# EAGLE design SmartVision (EAGLE 7.3.0)

## Sheet 1 of 4
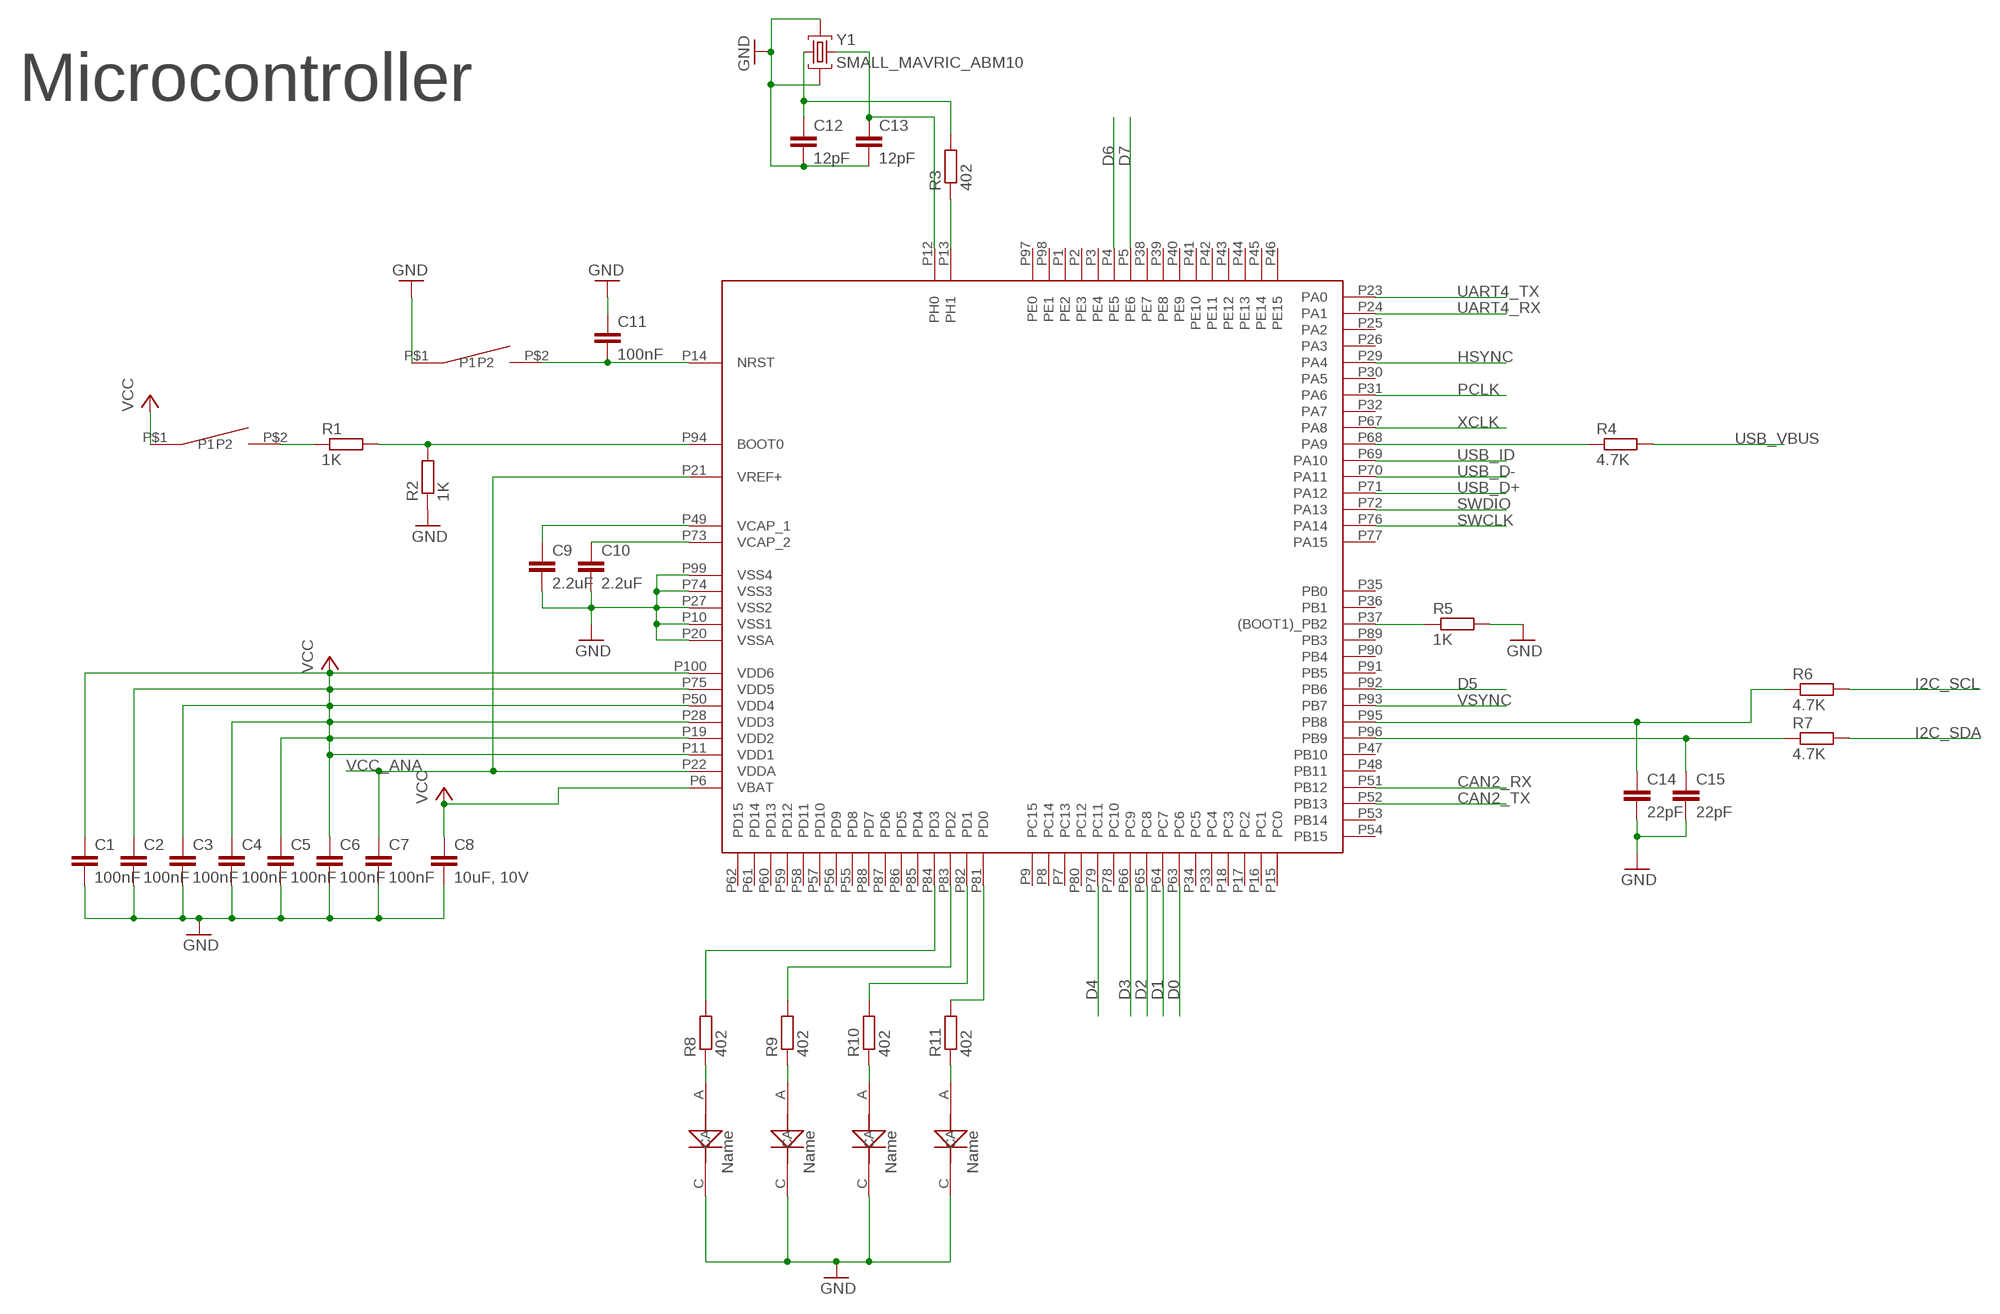
[diagram p0: schematic, sheet 1]

### Parts
C1  100nF  SMALL_MAVRIC_CAPACITOR_C0402  [SMALL_MAVRIC_SMALL_MAVRIC_CAPACITOR_C0402]
C2  100nF  SMALL_MAVRIC_CAPACITOR_C0402  [SMALL_MAVRIC_SMALL_MAVRIC_CAPACITOR_C0402]
C3  100nF  SMALL_MAVRIC_CAPACITOR_C0402  [SMALL_MAVRIC_SMALL_MAVRIC_CAPACITOR_C0402]
C4  100nF  SMALL_MAVRIC_CAPACITOR_C0402  [SMALL_MAVRIC_SMALL_MAVRIC_CAPACITOR_C0402]
C5  100nF  SMALL_MAVRIC_CAPACITOR_C0402  [SMALL_MAVRIC_SMALL_MAVRIC_CAPACITOR_C0402]
C6  100nF  SMALL_MAVRIC_CAPACITOR_C0402  [SMALL_MAVRIC_SMALL_MAVRIC_CAPACITOR_C0402]
C7  100nF  SMALL_MAVRIC_CAPACITOR_C0402  [SMALL_MAVRIC_SMALL_MAVRIC_CAPACITOR_C0402]
C8  10uF, 10V  SMALL_MAVRIC_CAPACITOR_C0603  [SMALL_MAVRIC_SMALL_MAVRIC_CAPACITOR_C0603]
C9  2.2uF  SMALL_MAVRIC_CAPACITOR_C0402  [SMALL_MAVRIC_SMALL_MAVRIC_CAPACITOR_C0402]
C10  2.2uF  SMALL_MAVRIC_CAPACITOR_C0402  [SMALL_MAVRIC_SMALL_MAVRIC_CAPACITOR_C0402]
C11  100nF  SMALL_MAVRIC_CAPACITOR_C0402  [SMALL_MAVRIC_SMALL_MAVRIC_CAPACITOR_C0402]
C12  12pF  SMALL_MAVRIC_CAPACITOR_C0402  [SMALL_MAVRIC_SMALL_MAVRIC_CAPACITOR_C0402]
C13  12pF  SMALL_MAVRIC_CAPACITOR_C0402  [SMALL_MAVRIC_SMALL_MAVRIC_CAPACITOR_C0402]
C14  22pF  SMALL_MAVRIC_CAPACITOR_C0402  [SMALL_MAVRIC_SMALL_MAVRIC_CAPACITOR_C0402]
C15  22pF  SMALL_MAVRIC_CAPACITOR_C0402  [SMALL_MAVRIC_SMALL_MAVRIC_CAPACITOR_C0402]
R1  1K  SMALL_MAVRIC_RESISTOR_R0402  [SMALL_MAVRIC_SMALL_MAVRIC_RESISTOR_R0402]
R2  1K  SMALL_MAVRIC_RESISTOR_R0402  [SMALL_MAVRIC_SMALL_MAVRIC_RESISTOR_R0402]
R3  402  SMALL_MAVRIC_RESISTOR_R0402  [SMALL_MAVRIC_SMALL_MAVRIC_RESISTOR_R0402]
R4  4.7K  SMALL_MAVRIC_RESISTOR_R0402  [SMALL_MAVRIC_SMALL_MAVRIC_RESISTOR_R0402]
R5  1K  SMALL_MAVRIC_RESISTOR_R0402  [SMALL_MAVRIC_SMALL_MAVRIC_RESISTOR_R0402]
R6  4.7K  SMALL_MAVRIC_RESISTOR_R0402  [SMALL_MAVRIC_SMALL_MAVRIC_RESISTOR_R0402]
R7  4.7K  SMALL_MAVRIC_RESISTOR_R0402  [SMALL_MAVRIC_SMALL_MAVRIC_RESISTOR_R0402]
R8  402  SMALL_MAVRIC_RESISTOR_R0402  [SMALL_MAVRIC_SMALL_MAVRIC_RESISTOR_R0402]
R9  402  SMALL_MAVRIC_RESISTOR_R0402  [SMALL_MAVRIC_SMALL_MAVRIC_RESISTOR_R0402]
R10  402  SMALL_MAVRIC_RESISTOR_R0402  [SMALL_MAVRIC_SMALL_MAVRIC_RESISTOR_R0402]
R11  402  SMALL_MAVRIC_RESISTOR_R0402  [SMALL_MAVRIC_SMALL_MAVRIC_RESISTOR_R0402]
U$1  STM32F407VGT6-100  [STM32F407VGT6-100]
U$29  SWITCH_OFF_(ON)  [SWITCH_OFF_(ON)]
U$31  SWITCH_OFF_(ON)  [SWITCH_OFF_(ON)]
U$40  LED  [LED]
U$41  LED  [LED]
U$42  LED  [LED]
U$43  LED  [LED]
Y1  SMALL_MAVRIC_ABM10  [SMALL_MAVRIC_OSCILLATOR_ABM10]

### Nets
CAN2_RX: U$1.P51(PB12) ; also sheet 3
CAN2_TX: U$1.P52(PB13) ; also sheet 3
D0: U$1.P63(PC6) ; also sheet 3
D1: U$1.P64(PC7) ; also sheet 3
D2: U$1.P65(PC8) ; also sheet 3
D3: U$1.P66(PC9) ; also sheet 3
D4: U$1.P79(PC11) ; also sheet 3
D5: U$1.P92(PB6) ; also sheet 3
D6: U$1.P4(PE5) ; also sheet 3
D7: U$1.P5(PE6) ; also sheet 3
GND: C1.2 C2.2 C3.2 C4.2 C5.2 C6.2 C7.2 C8.2 C9.2 C10.2 C11.1 C12.2 C13.2 C14.2 C15.2 R2.1 R5.2 U$1.P10(VSS1) U$1.P20(VSSA) U$1.P27(VSS2) U$1.P74(VSS3) U$1.P99(VSS4) U$29.P$1(P1) U$40.C U$41.C U$42.C U$43.C Y1.2 Y1.4 ; also sheet 2,3,4
HSYNC: U$1.P29(PA4) ; also sheet 3
I2C_SCL: R6.2 ; also sheet 3,4
I2C_SDA: R7.2 ; also sheet 3,4
N$4: R11.2 U$1.P81(PD0)
N$5: R10.2 U$1.P82(PD1)
N$6: R9.2 U$1.P83(PD2)
N$7: R8.2 U$1.P84(PD3)
N$8: C13.1 U$1.P12(PH0) Y1.3
N$9: R8.1 U$40.A
N$10: C12.1 R3.2 Y1.1
N$11: R9.1 U$41.A
N$12: R10.1 U$42.A
N$13: R3.1 U$1.P13(PH1)
N$14: C15.1 R7.1 U$1.P96(PB9)
N$15: C9.1 U$1.P49(VCAP_1)
N$16: C10.1 U$1.P73(VCAP_2)
N$17: C14.1 R6.1 U$1.P95(PB8)
N$18: R4.1 U$1.P68(PA9)
N$19: C11.2 U$1.P14(NRST) U$29.P$2(P2)
N$20: R1.1 U$31.P$2(P2)
N$21: R1.2 R2.2 U$1.P94(BOOT0)
N$22: R5.1 U$1.P37((BOOT1)_PB2)
N$23: R11.1 U$43.A
PCLK: U$1.P31(PA6) ; also sheet 3
SWCLK: U$1.P76(PA14) ; also sheet 3
SWDIO: U$1.P72(PA13) ; also sheet 3
UART4_RX: U$1.P24(PA1) ; also sheet 3
UART4_TX: U$1.P23(PA0) ; also sheet 3
USB_D+: U$1.P71(PA12) ; also sheet 3
USB_D-: U$1.P70(PA11) ; also sheet 3
USB_ID: U$1.P69(PA10) ; also sheet 3
USB_VBUS: R4.2 ; also sheet 2,3
VCC: C1.1 C2.1 C3.1 C4.1 C5.1 C6.1 C8.1 U$1.P6(VBAT) U$1.P11(VDD1) U$1.P19(VDD2) U$1.P28(VDD3) U$1.P50(VDD4) U$1.P75(VDD5) U$1.P100(VDD6) U$31.P$1(P1) ; also sheet 2,3,4
VCC_ANA: C7.1 U$1.P21(VREF+) U$1.P22(VDDA) ; also sheet 2,3,4
VSYNC: U$1.P93(PB7) ; also sheet 3
XCLK: U$1.P67(PA8) ; also sheet 3
Unconnected: U$1.P1(PE2) U$1.P2(PE3) U$1.P3(PE4) U$1.P7(PC13) U$1.P8(PC14) U$1.P9(PC15) U$1.P15(PC0) U$1.P16(PC1) U$1.P17(PC2) U$1.P18(PC3) U$1.P25(PA2) U$1.P26(PA3) U$1.P30(PA5) U$1.P32(PA7) U$1.P33(PC4) U$1.P34(PC5) U$1.P35(PB0) U$1.P36(PB1) U$1.P38(PE7) U$1.P39(PE8) U$1.P40(PE9) U$1.P41(PE10) U$1.P42(PE11) U$1.P43(PE12) U$1.P44(PE13) U$1.P45(PE14) U$1.P46(PE15) U$1.P47(PB10) U$1.P48(PB11) U$1.P53(PB14) U$1.P54(PB15) U$1.P55(PD8) U$1.P56(PD9) U$1.P57(PD10) U$1.P58(PD11) U$1.P59(PD12) U$1.P60(PD13) U$1.P61(PD14) U$1.P62(PD15) U$1.P77(PA15) U$1.P78(PC10) U$1.P80(PC12) U$1.P85(PD4) U$1.P86(PD5) U$1.P87(PD6) U$1.P88(PD7) U$1.P89(PB3) U$1.P90(PB4) U$1.P91(PB5) U$1.P97(PE0) U$1.P98(PE1)

### Notes on the sheet
- Microcontroller

## Sheet 2 of 4
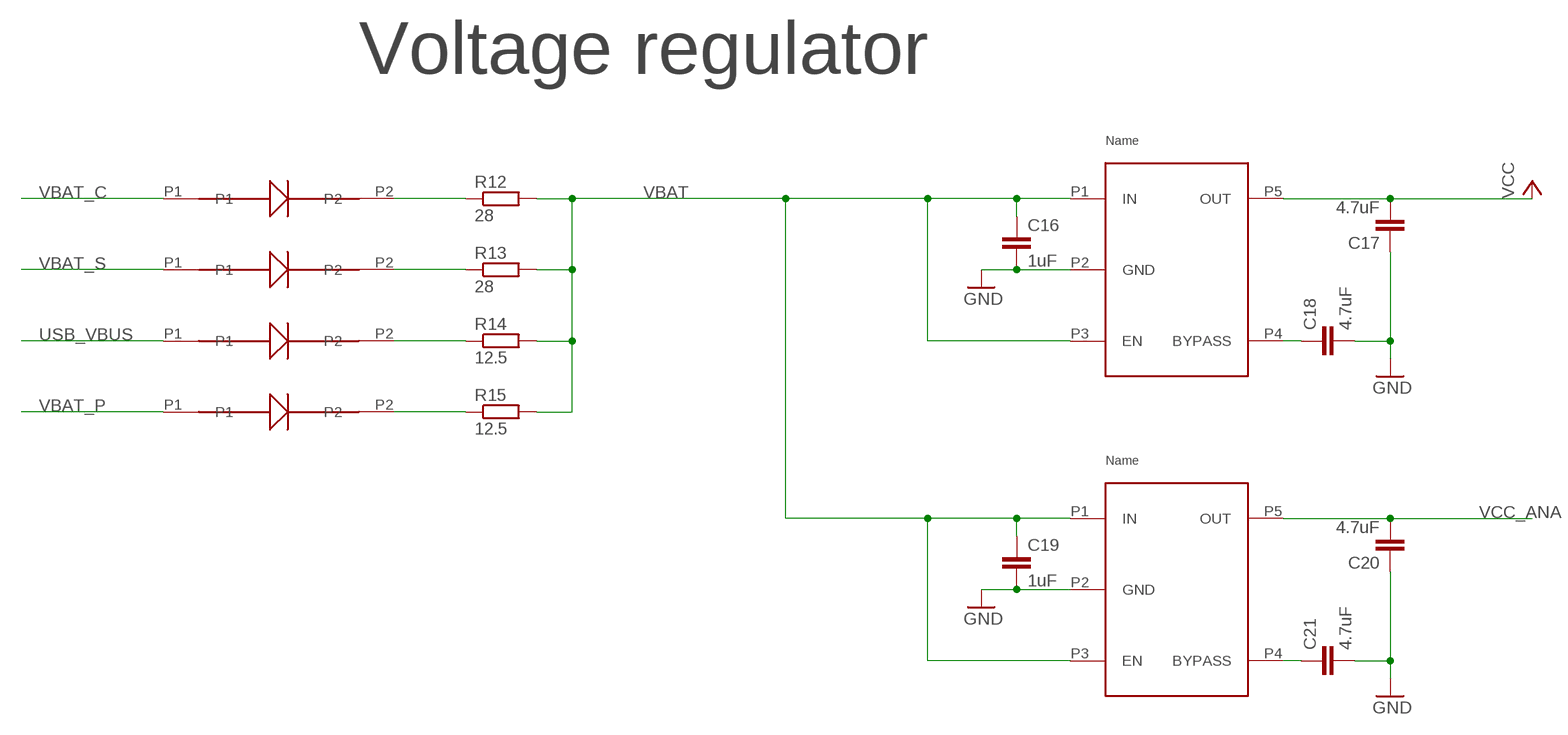
[diagram p1: schematic, sheet 2]

### Parts
C16  1uF  SMALL_MAVRIC_CAPACITOR_C0402  [SMALL_MAVRIC_SMALL_MAVRIC_CAPACITOR_C0402]
C17  4.7uF  SMALL_MAVRIC_CAPACITOR_C0603  [SMALL_MAVRIC_SMALL_MAVRIC_CAPACITOR_C0603]
C18  4.7uF  SMALL_MAVRIC_CAPACITOR_C0603  [SMALL_MAVRIC_SMALL_MAVRIC_CAPACITOR_C0603]
C19  1uF  SMALL_MAVRIC_CAPACITOR_C0402  [SMALL_MAVRIC_SMALL_MAVRIC_CAPACITOR_C0402]
C20  4.7uF  SMALL_MAVRIC_CAPACITOR_C0603  [SMALL_MAVRIC_SMALL_MAVRIC_CAPACITOR_C0603]
C21  4.7uF  SMALL_MAVRIC_CAPACITOR_C0603  [SMALL_MAVRIC_SMALL_MAVRIC_CAPACITOR_C0603]
R12  28  SMALL_MAVRIC_RESISTOR_R0402  [SMALL_MAVRIC_SMALL_MAVRIC_RESISTOR_R0402]
R13  28  SMALL_MAVRIC_RESISTOR_R0402  [SMALL_MAVRIC_SMALL_MAVRIC_RESISTOR_R0402]
R14  12.5  SMALL_MAVRIC_RESISTOR_R0402  [SMALL_MAVRIC_SMALL_MAVRIC_RESISTOR_R0402]
R15  12.5  SMALL_MAVRIC_RESISTOR_R0402  [SMALL_MAVRIC_SMALL_MAVRIC_RESISTOR_R0402]
U$2  VOLTAGE_REGULATOR_3V  [VOLTAGE_REGULATOR_3V]
U$7  VOLTAGE_REGULATOR_3V  [VOLTAGE_REGULATOR_3V]
U$54  DIODE_SCHOTTKY  [DIODE_SCHOTTKY]
U$55  DIODE_SCHOTTKY  [DIODE_SCHOTTKY]
U$57  DIODE_SCHOTTKY  [DIODE_SCHOTTKY]
U$61  DIODE_SCHOTTKY  [DIODE_SCHOTTKY]

### Nets
GND: C16.2 C17.1 C18.2 C19.2 C20.1 C21.2 U$2.P2(GND) U$7.P2(GND) ; also sheet 1,3,4
N$1: C21.1 U$7.P4(BYPASS)
N$2: C18.1 U$2.P4(BYPASS)
N$24: R13.1 U$61.P2
N$25: R15.1 U$54.P2
N$27: R12.1 U$55.P2
N$29: R14.1 U$57.P2
USB_VBUS: U$57.P1 ; also sheet 1,3
VBAT: C16.1 C19.1 R12.2 R13.2 R14.2 R15.2 U$2.P1(IN) U$2.P3(EN) U$7.P1(IN) U$7.P3(EN) ; also sheet 3
VBAT_C: U$55.P1 ; also sheet 3
VBAT_P: U$54.P1 ; also sheet 3
VBAT_S: U$61.P1 ; also sheet 3
VCC: C17.2 U$2.P5(OUT) ; also sheet 1,3,4
VCC_ANA: C20.2 U$7.P5(OUT) ; also sheet 1,3,4

### Notes on the sheet
- Voltage regulator

## Sheet 3 of 4
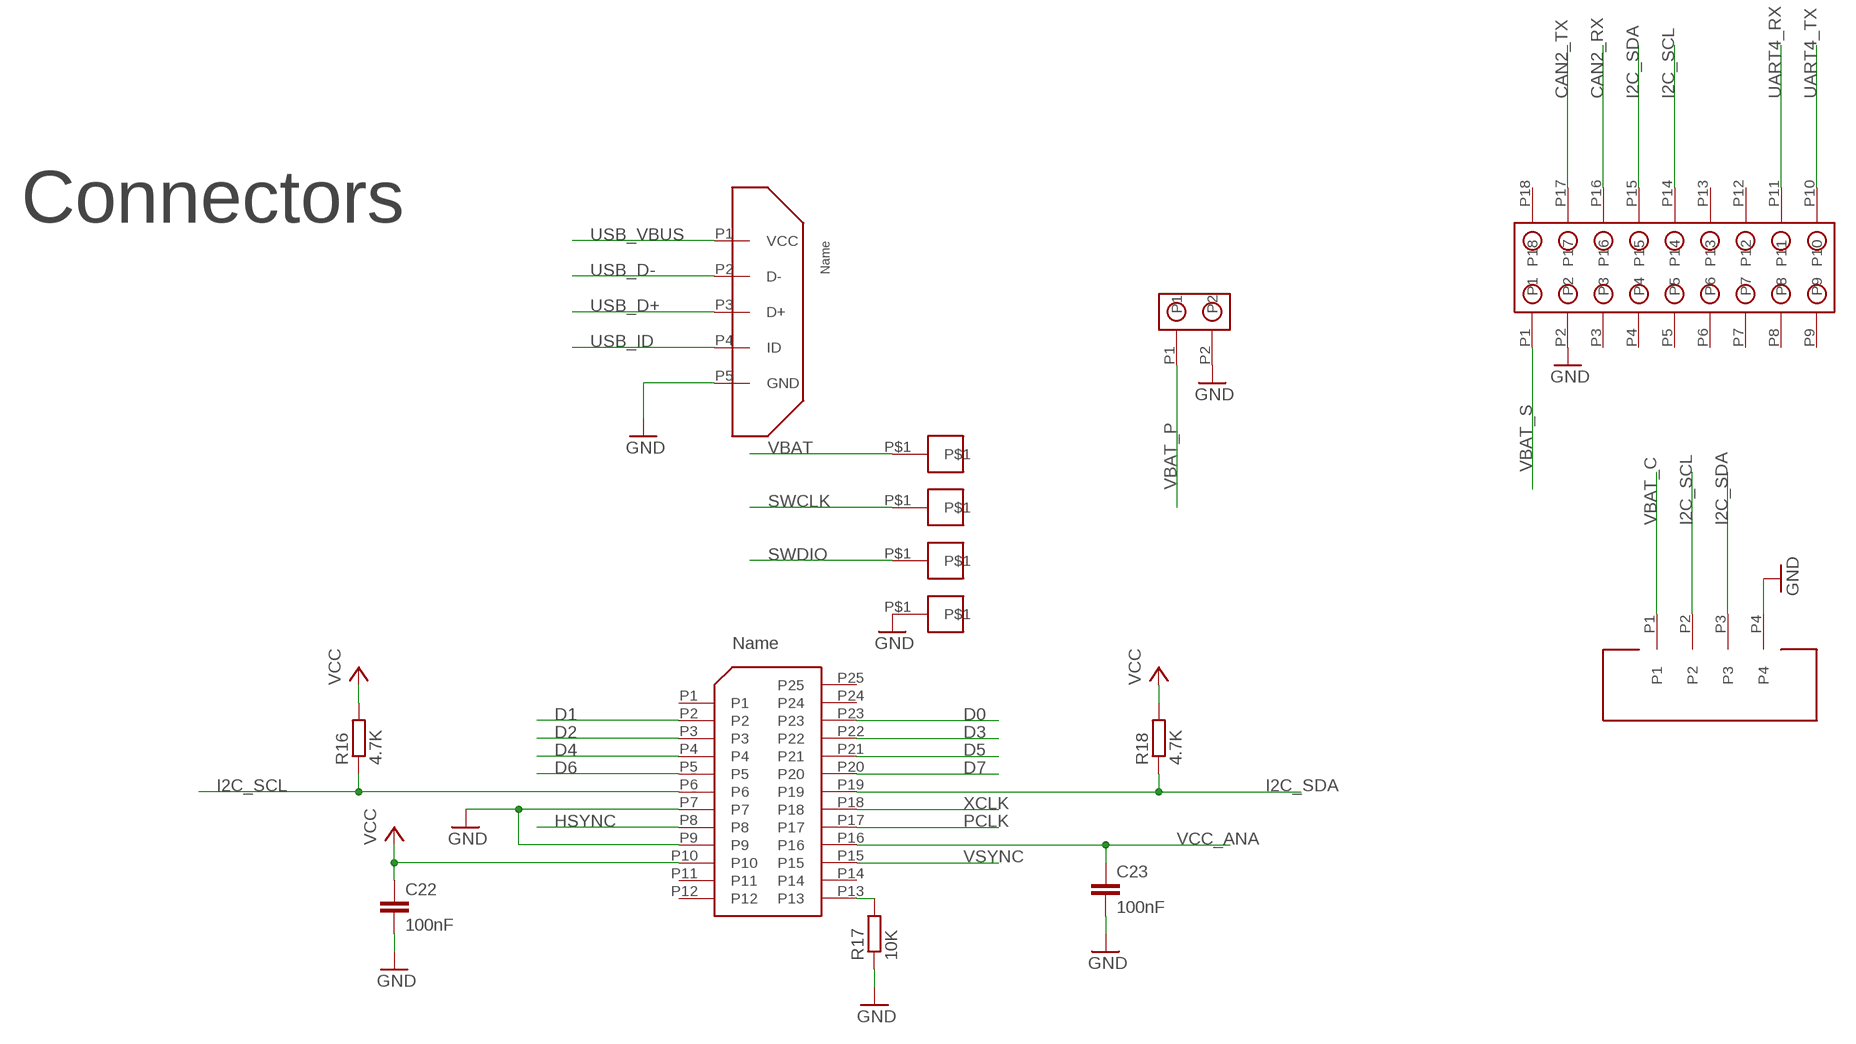
[diagram p2: schematic, sheet 3]

### Parts
C22  100nF  SMALL_MAVRIC_CAPACITOR_C0402  [SMALL_MAVRIC_SMALL_MAVRIC_CAPACITOR_C0402]
C23  100nF  SMALL_MAVRIC_CAPACITOR_C0402  [SMALL_MAVRIC_SMALL_MAVRIC_CAPACITOR_C0402]
R16  4.7K  SMALL_MAVRIC_RESISTOR_R0402  [SMALL_MAVRIC_SMALL_MAVRIC_RESISTOR_R0402]
R17  10K  SMALL_MAVRIC_RESISTOR_R0402  [SMALL_MAVRIC_SMALL_MAVRIC_RESISTOR_R0402]
R18  4.7K  SMALL_MAVRIC_RESISTOR_R0402  [SMALL_MAVRIC_SMALL_MAVRIC_RESISTOR_R0402]
U$3  PAD_FLASH  [PAD_FLASH]
U$4  MICRO_USB_PLUG  [MICRO_USB_PLUG]
U$5  PAD_FLASH  [PAD_FLASH]
U$11  CON_CAMERA_FPC_25P_0.3MM  [CON_CAMERA_FPC_25P_0.3MM]
U$52  CON_2.54MM_18PINS_STACKABLE  [CON_2.54MM_18PINS_STACKABLE]
U$53  CON_1.25MM_4PINS  [CON_1.25MM_4PINS]
U$59  CON_2.54MM_2PINS  [CON_2.54MM_2PINS]
U$63  PAD_FLASH  [PAD_FLASH]
U$64  PAD_FLASH  [PAD_FLASH]

### Nets
CAN2_RX: U$52.P16 ; also sheet 1
CAN2_TX: U$52.P17 ; also sheet 1
D0: U$11.P23 ; also sheet 1
D1: U$11.P2 ; also sheet 1
D2: U$11.P3 ; also sheet 1
D3: U$11.P22 ; also sheet 1
D4: U$11.P4 ; also sheet 1
D5: U$11.P21 ; also sheet 1
D6: U$11.P5 ; also sheet 1
D7: U$11.P20 ; also sheet 1
GND: C22.2 C23.2 R17.1 U$3.P$1 U$4.P5(GND) U$11.P7 U$11.P9 U$52.P2 U$53.P4 U$59.P2 ; also sheet 1,2,4
HSYNC: U$11.P8 ; also sheet 1
I2C_SCL: R16.1 U$11.P6 U$52.P14 U$53.P2 ; also sheet 1,4
I2C_SDA: R18.1 U$11.P19 U$52.P15 U$53.P3 ; also sheet 1,4
N$3: R17.2 U$11.P13
PCLK: U$11.P17 ; also sheet 1
SWCLK: U$63.P$1 ; also sheet 1
SWDIO: U$64.P$1 ; also sheet 1
UART4_RX: U$52.P11 ; also sheet 1
UART4_TX: U$52.P10 ; also sheet 1
USB_D+: U$4.P3(D+) ; also sheet 1
USB_D-: U$4.P2(D-) ; also sheet 1
USB_ID: U$4.P4(ID) ; also sheet 1
USB_VBUS: U$4.P1(VCC) ; also sheet 1,2
VBAT: U$5.P$1 ; also sheet 2
VBAT_C: U$53.P1 ; also sheet 2
VBAT_P: U$59.P1 ; also sheet 2
VBAT_S: U$52.P1 ; also sheet 2
VCC: C22.1 R16.2 R18.2 U$11.P10 ; also sheet 1,2,4
VCC_ANA: C23.1 U$11.P16 ; also sheet 1,2,4
VSYNC: U$11.P15 ; also sheet 1
XCLK: U$11.P18 ; also sheet 1
Unconnected: U$11.P1 U$11.P11 U$11.P12 U$11.P14 U$11.P24 U$11.P25 U$52.P3 U$52.P4 U$52.P5 U$52.P6 U$52.P7 U$52.P8 U$52.P9 U$52.P12 U$52.P13 U$52.P18

### Notes on the sheet
- Connectors

## Sheet 4 of 4
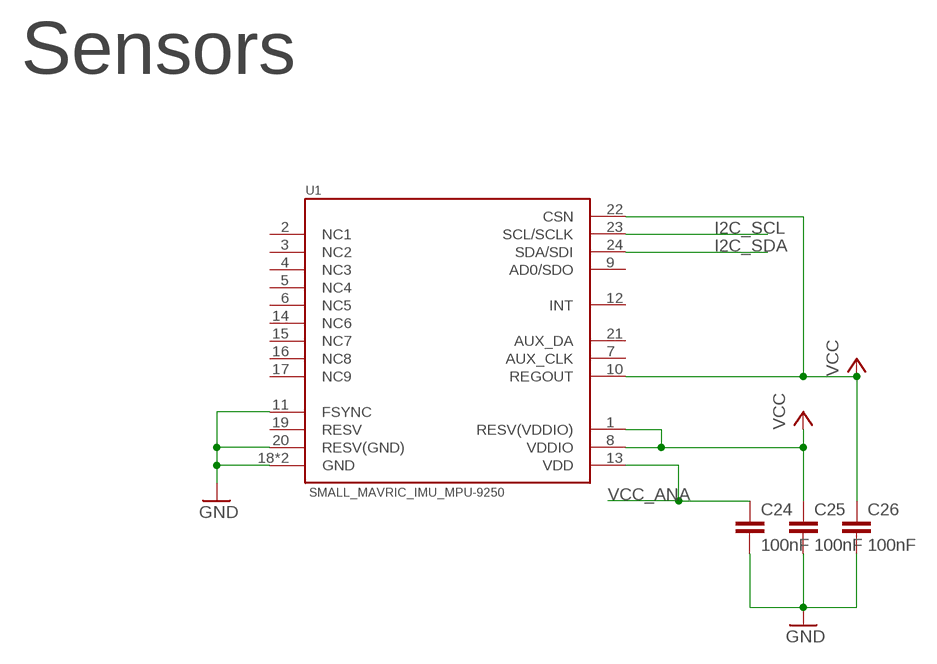
[diagram p3: schematic, sheet 4]

### Parts
C24  100nF  SMALL_MAVRIC_CAPACITOR_C0402  [SMALL_MAVRIC_SMALL_MAVRIC_CAPACITOR_C0402]
C25  100nF  SMALL_MAVRIC_CAPACITOR_C0402  [SMALL_MAVRIC_SMALL_MAVRIC_CAPACITOR_C0402]
C26  100nF  SMALL_MAVRIC_CAPACITOR_C0402  [SMALL_MAVRIC_SMALL_MAVRIC_CAPACITOR_C0402]
U1  SMALL_MAVRIC_IMU_MPU-9250  [SMALL_MAVRIC_SMALL_MAVRIC_QFN-24_3.0X3.0MM]

### Nets
GND: C24.2 C25.2 C26.2 U1.11(FSYNC) U1.18(GND) U1.20(RESV(GND)) U1.CENTRAL_PAD(GND) ; also sheet 1,2,3
I2C_SCL: U1.23(SCL/SCLK) ; also sheet 1,3
I2C_SDA: U1.24(SDA/SDI) ; also sheet 1,3
VCC: C25.1 C26.1 U1.1(RESV(VDDIO)) U1.8(VDDIO) U1.10(REGOUT) U1.22(CSN) ; also sheet 1,2,3
VCC_ANA: C24.1 U1.13(VDD) ; also sheet 1,2,3
Unconnected: U1.2(NC1) U1.3(NC2) U1.4(NC3) U1.5(NC4) U1.6(NC5) U1.7(AUX_CLK) U1.9(AD0/SDO) U1.12(INT) U1.14(NC6) U1.15(NC7) U1.16(NC8) U1.17(NC9) U1.19(RESV) U1.21(AUX_DA)

### Notes on the sheet
- Sensors

## Library data of the parts
C1-C26 = small_mavric:SMALL_MAVRIC_CAPACITOR_; PLACE_PART: YES
R1-R18 = small_mavric:SMALL_MAVRIC_RESISTOR_; PLACE_PART: YES
U1 = small_mavric:SMALL_MAVRIC_IMU_MPU-9250; DISTRIBUTOR: digikey; ORDER_CODE: 1428-1019-1-ND; PLACE_PART: YES
U$1 = STM32F4:STM32F407VGT6-100: Stm32F407VGT6 microcontroler with LQFP100 footprint (100 pins)
U$2 U$7 = STM32F4:VOLTAGE_REGULATOR_3V
U$3 U$5 U$63 U$64 = STM32F4:PAD_FLASH
U$4 = STM32F4:MICRO_USB_PLUG
U$11 = STM32F4:CON_CAMERA_FPC_25P_0.3MM
U$29 U$31 = STM32F4:SWITCH_OFF_(ON)
U$40-U$43 = STM32F4:LED
U$52 = STM32F4:CON_2.54MM_18PINS_STACKABLE
U$53 = STM32F4:CON_1.25MM_4PINS
U$54 U$55 U$57 U$61 = STM32F4:DIODE_SCHOTTKY
U$59 = STM32F4:CON_2.54MM_2PINS
Y1 = small_mavric:SMALL_MAVRIC_ABM10; DISTRIBUTOR: mouser; MF_NUM: 815-ABM10-25-E20-T

## Board
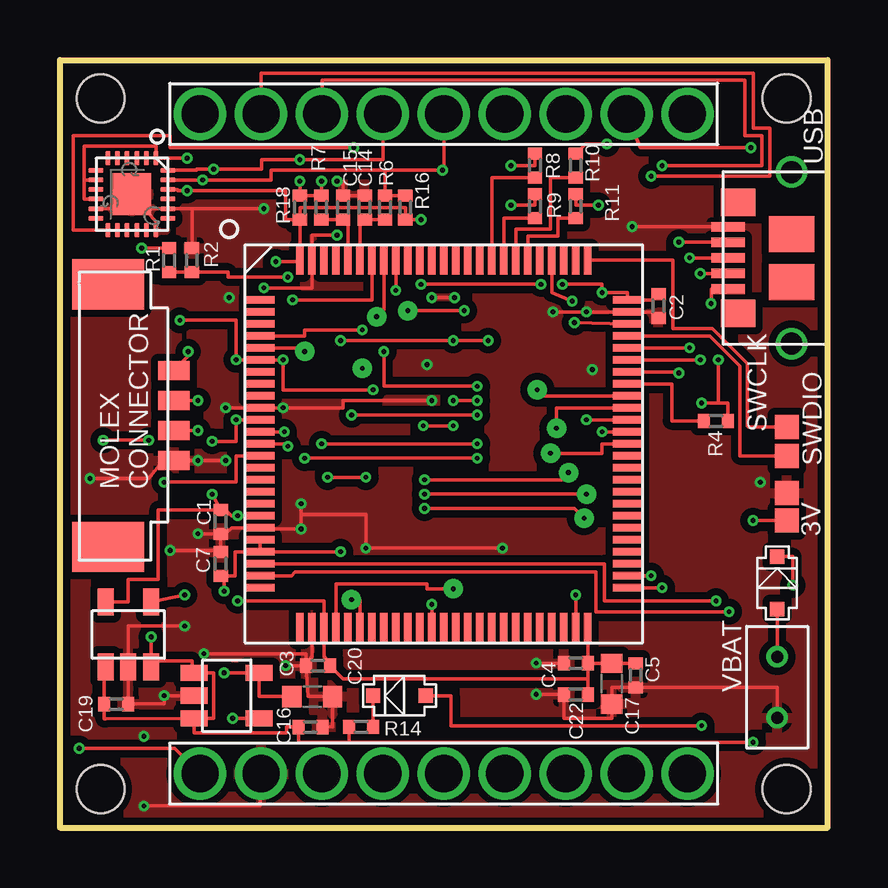
[diagram p4: board, top side]
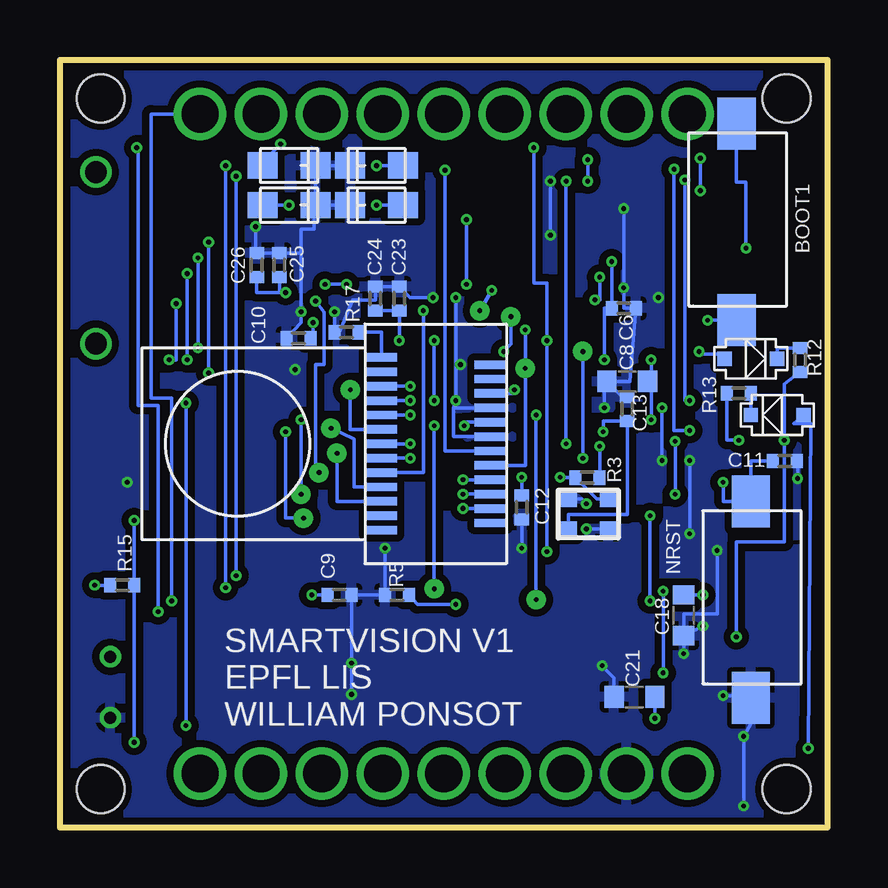
[diagram p5: board, bottom side, seen from below]

Size 32 x 32 mm. Coordinates in mm from the lower left corner, seen from the top.
Outline: 0,0 0,32 32,32 32,0 0,0
Copper layers (1*16): Top 0.035mm / dielectric 1.5mm / Bottom 0.035mm
Design rules "PCB-POOL Standard *": minimum track width 0.125mm, minimum drill 0.2mm, track to track 0.125mm, track to pad 0.125mm, pad to pad 0.125mm, via to via 0.125mm, smd to smd 0.125mm, copper to edge 0.3mm, drill to drill 0.2mm, minimum pad ring 0.2mm, minimum via ring 0.125mm, stop-mask expansion 0.075mm, vias tented up to drill 0mil, thermal gap 0.2mm
Holes 2 mm at 30.3,1.6 30.3,30.4 1.7,1.6 1.7,30.4

### Footprints (pad centres in the part's own frame; a part is rotated, then mirrored left to right if it is on the bottom)
SMALL_MAVRIC_SMALL_MAVRIC_CAPACITOR_C0402 = smd 0.5 x 0.6: 1 -0.5,0; 2 0.5,0
SMALL_MAVRIC_SMALL_MAVRIC_CAPACITOR_C0603 = smd 0.8 x 0.9: 1 -0.85,0; 2 0.85,0
SMALL_MAVRIC_SMALL_MAVRIC_RESISTOR_R0402 = smd 0.5 x 0.6: 1 -0.5,0; 2 0.5,0
SMALL_MAVRIC_SMALL_MAVRIC_QFN-24_3.0X3.0MM = smd 0.6 x 0.2: 1 -1.5,1; 2 -1.5,0.6; 3 -1.5,0.2; 4 -1.5,-0.2; 5 -1.5,-0.6; 6 -1.5,-1; 13 1.5,-1; 14 1.5,-0.6; 15 1.5,-0.2; 16 1.5,0.2; 17 1.5,0.6; 18 1.5,1 | smd 0.2 x 0.6: 7 -1,-1.5; 8 -0.6,-1.5; 9 -0.2,-1.5; 10 0.2,-1.5; 11 0.6,-1.5; 12 1,-1.5; 19 1,1.5; 20 0.6,1.5; 21 0.2,1.5; 22 -0.2,1.5; 23 -0.6,1.5; 24 -1,1.5 | smd 1.75 x 1.6: CENTRAL_PAD 0,0
STM32F407VGT6-100 = smd 0.3 x 1.2: P1 -6,-7.65; P2 -5.5,-7.65; P3 -5,-7.65; P4 -4.5,-7.65; P5 -4,-7.65; P6 -3.5,-7.65; P7 -3,-7.65; P8 -2.5,-7.65; P9 -2,-7.65; P10 -1.5,-7.65; P11 -1,-7.65; P12 -0.5,-7.65; P13 0,-7.65; P14 0.5,-7.65; P15 1,-7.65; P16 1.5,-7.65; P17 2,-7.65; P18 2.5,-7.65; P19 3,-7.65; P20 3.5,-7.65; P21 4,-7.65; P22 4.5,-7.65; P23 5,-7.65; P24 5.5,-7.65; P25 6,-7.65; P51 6,7.65; P52 5.5,7.65; P53 5,7.65; P54 4.5,7.65; P55 4,7.65; P56 3.5,7.65; P57 3,7.65; P58 2.5,7.65; P59 2,7.65; P60 1.5,7.65; P61 1,7.65; P62 0.5,7.65; P63 0,7.65; P64 -0.5,7.65; P65 -1,7.65; P66 -1.5,7.65; P67 -2,7.65; P68 -2.5,7.65; P69 -3,7.65; P70 -3.5,7.65; P71 -4,7.65; P72 -4.5,7.65; P73 -5,7.65; P74 -5.5,7.65; P75 -6,7.65 | smd 1.2 x 0.3: P26 7.65,-6; P27 7.65,-5.5; P28 7.65,-5; P29 7.65,-4.5; P30 7.65,-4; P31 7.65,-3.5; P32 7.65,-3; P33 7.65,-2.5; P34 7.65,-2; P35 7.65,-1.5; P36 7.65,-1; P37 7.65,-0.5; P38 7.65,0; P39 7.65,0.5; P40 7.65,1; P41 7.65,1.5; P42 7.65,2; P43 7.65,2.5; P44 7.65,3; P45 7.65,3.5; P46 7.65,4; P47 7.65,4.5; P48 7.65,5; P49 7.65,5.5; P50 7.65,6; P76 -7.65,6; P77 -7.65,5.5; P78 -7.65,5; P79 -7.65,4.5; P80 -7.65,4; P81 -7.65,3.5; P82 -7.65,3; P83 -7.65,2.5; P84 -7.65,2; P85 -7.65,1.5; P86 -7.65,1; P87 -7.65,0.5; P88 -7.65,0; P89 -7.65,-0.5; P90 -7.65,-1; P91 -7.65,-1.5; P92 -7.65,-2; P93 -7.65,-2.5; P94 -7.65,-3; P95 -7.65,-3.5; P96 -7.65,-4; P97 -7.65,-4.5; P98 -7.65,-5; P99 -7.65,-5.5; P100 -7.65,-6
VOLTAGE_REGULATOR_3V = smd 0.67 x 1.12: P1 -0.95,-1.35; P2 0,-1.35; P3 0.95,-1.35; P4 0.95,1.35; P5 -0.95,1.35
PAD_FLASH = smd 1 x 1: P$1 0,0
MICRO_USB_PLUG = smd 0.4 x 1.4: P1 -1.3,4.1; P2 -0.65,4.1; P3 0,4.1; P4 0.65,4.1; P5 1.3,4.1 | drill 0.91 pad 1.31: P$1 -3.575,1.45; P$2 3.575,1.45 | smd 1.5 x 1.9: P$3 -1,1.45; P$4 1,1.45 | smd 1.15 x 1.45: P$5 2.32,3.68; P$6 -2.32,3.68
CON_CAMERA_FPC_25P_0.3MM = smd 0.35 x 1.3: P1 3.3,4.525; P2 2.7,4.525; P3 2.1,4.525; P4 1.5,4.525; P5 0.9,4.525; P6 0.3,4.525; P7 -0.3,4.525; P8 -0.9,4.525; P9 -1.5,4.525; P10 -2.1,4.525; P11 -2.7,4.525; P12 -3.3,4.525; P13 -3.6,0; P14 -3,0; P15 -2.4,0; P16 -1.8,0; P17 -1.2,0; P18 -0.6,0; P19 0,0; P20 0.6,0; P21 1.2,0; P22 1.8,0; P23 2.4,0; P24 3,0; P25 3.6,0
SWITCH_OFF_(ON) = smd 2.18 x 1.6: P$1 -4.595,0; P$2 3.595,0
LED = smd 1.25 x 1.1: A -1.1,0; C 1.1,0
CON_2.54MM_18PINS_STACKABLE = drill 1.55 pad 2.184: P1 -10.16,0; P2 -7.62,0; P3 -5.08,0; P4 -2.54,0; P5 0,0; P6 2.54,0; P7 5.08,0; P8 7.62,0; P9 10.16,0; P10 10.16,27.5; P11 7.62,27.5; P12 5.08,27.5; P13 2.54,27.5; P14 0,27.5; P15 -2.54,27.5; P16 -5.08,27.5; P17 -7.62,27.5; P18 -10.16,27.5
CON_1.25MM_4PINS = smd 0.8 x 1.3: P1 3.6,2.75; P2 4.85,2.75; P3 6.1,2.75; P4 7.35,2.75 | smd 2.1 x 3: P$1 0,0; P$6 10.95,0
DIODE_SCHOTTKY = smd 0.6 x 0.6: P1 -1.1,0; P2 1.1,0
CON_2.54MM_2PINS = drill 0.5 pad 0.813: P1 -1.27,0; P2 1.27,0
SMALL_MAVRIC_OSCILLATOR_ABM10 = smd 0.7 x 0.65: 1 -0.825,-0.625; 2 0.825,-0.625; 3 0.825,0.625; 4 -0.825,0.625

### Placement (x,y rotation side)
C1  6.7,12.75 270 top
C2  24.95,21.75 270 top
C3  10.75,6.75 180 top
C4  21.5,6.85 180 top
C5  24,6.35 270 top
C6  8.5,21.65 0 bottom
C7  6.7,11 90 top
C8  8.35,18.6 180 bottom
C9  20.35,9.7 0 bottom
C10  22.05,20.4 180 bottom
C11  1.78,15.28 180 bottom
C12  12.75,13.35 270 bottom
C13  8.35,17.45 90 bottom
C14  12.7,25.85 90 top
C15  11.8,25.85 90 top
C16  10.44,4.19 0 top
C17  23,6 90 top
C18  6,8.85 270 bottom
C19  2.35,5.15 0 top
C20  10.52,5.46 180 top
C21  8.05,5.45 180 bottom
C22  21.5,5.55 180 top
C23  17.85,22.05 90 bottom
C24  18.85,22.05 90 bottom
C25  22.85,23.45 90 bottom
C26  23.8,23.45 90 bottom
R1  4.55,23.65 270 top
R2  5.5,23.65 270 top
R3  10.02,14.59 180 bottom
R4  27.35,16.95 0 top
R5  17.95,9.7 180 bottom
R6  13.55,25.85 90 top
R7  10.9,25.85 90 top
R8  19.8,27.6 270 top
R9  19.8,25.9 270 top
R10  21.5,27.6 270 top
R11  21.5,25.9 270 top
R12  1.15,19.5 270 bottom
R13  3.7,18.1 180 bottom
R14  12.55,4.2 180 top
R15  29.4,10.1 0 bottom
R16  14.4,25.85 270 top
R17  20.05,20.65 0 bottom
R18  10,25.85 270 top
U1  3,26.4 270 top
U$1  16,16 270 top
U$2  2.85,8.05 0 top
U$3  30.3,13.95 0 top
U$4  31.95,23.75 90 top
U$5  30.3,12.8 0 top
U$7  6.95,5.5 270 top
U$11  18.59,16 270 bottom
U$29  3.2,10 90 bottom
U$31  3.8,25.75 90 bottom
U$40  18.8,27.6 180 bottom
U$41  18.8,25.95 180 bottom
U$42  22.45,27.6 0 bottom
U$43  22.45,25.95 0 bottom
U$52  16,2.25 0 top
U$53  2,22.65 270 top
U$54  29.9,10.2 90 top
U$55  3.2,19.55 0 bottom
U$57  14.15,5.5 180 top
U$59  29.9,5.85 270 top
U$61  2.1,17.2 180 bottom
U$63  30.3,16.7 0 top
U$64  30.3,15.5 0 top
Y1  9.97,13.07 180 bottom

### Tracks (layer width: path | path; a pad name or v marks a point on that pad's centre or on a via)
CAN2_RX  (via drill 0.2)
  Top 0.15: U$1.P51 v25.1,10 | v25.1,27.6 29.25,27.6 29.25,28.85 28.55,28.85 28.55,31.15 10.92,31.15 U$52.P16
  Bottom 0.15: v25.1,10 v25.1,27.6
CAN2_TX  (via drill 0.2)
  Top 0.15: U$1.P52 v24.65,10.5 | v24.65,27.15 29.6,27.15 29.6,29.15 28.9,29.15 28.9,31.45 8.38,31.45 U$52.P17
  Bottom 0.15: v24.65,10.5 v24.65,27.15
D0  (via drill 0.2 pad 0.81)
  Top 0.15: v20.45,15.6 22.6,15.6 22.6,16 U$1.P63
  Bottom 0.15: U$11.P23 20.45,13.6 v20.45,15.6
D1  (via drill 0.2, 0.2 pad 0.81)
  Top 0.15: v22.6,16.5 U$1.P64 | v15.2,13.3 21.45,13.3 v21.85,12.9
  Bottom 0.15: U$11.P2 v15.2,13.3 | v21.85,12.9 22.6,12.9 v22.6,16.5
D2  (via drill 0.2, 0.2 pad 0.81)
  Top 0.15: v15.2,13.9 v21.95,13.9 | v21.95,17 U$1.P65
  Bottom 0.15: U$11.P3 v15.2,13.9 | v21.95,13.9 v21.95,17
D3  (via drill 0.2 pad 0.81)
  Top 0.15: v20.7,16.65 20.7,17.5 U$1.P66
  Bottom 0.15: U$11.P22 19.75,14.2 19.75,16.2 v20.7,16.65
D4  (via drill 0.2, 0.2 pad 0.81)
  Top 0.15: v21.35,21.95 20.5,22.3 U$1.P79 | v15.2,14.5 20.9,14.5 v21.2,14.8
  Bottom 0.15: U$11.P4 v15.2,14.5 | v21.2,14.8 21.35,15.05 21.35,19.3 21,19.3 21,21.5 v21.35,21.95
D5  (via drill 0.2, 0.2 pad 0.81)
  Top 0.15: v16.85,21.55 v14.5,21.55 | v14,22.4 U$1.P92
  Bottom 0.15: U$11.P21 16.85,14.8 v16.85,21.55 | v14.5,21.55 v14,22.4
D6  (via drill 0.2, 0.2 pad 0.81)
  Top 0.15: U$1.P4 10.2,20.5 10.2,20.75 v12.6,20.75
  Bottom 0.15: U$11.P5 12.6,15.1 v12.6,19.15 v12.6,20.75
D7  (via drill 0.2, 0.2 pad 0.81)
  Top 0.15: v17.4,15.4 v10.2,15.4 | U$1.P5 10.2,20 v10.2,19.85
  Bottom 0.15: U$11.P20 v17.4,15.4 | v10.2,15.4 v10.2,19.85
GND  (via drill 0.2)
  Top 0.15: C14.2 C15.2 11.8,26.95 v11.55,26.95 | U1.11 3,25.8 | 3,25.8 U1.20 5.5,25.8 | 3,25.8 U1.CENTRAL_PAD 4,25.25 U1.18 | 5.5,25.8 v8.5,25.8 | v8.5,22.5 10.5,22.5 U$1.P99 10.5,24.7 v11.55,24.7 | C1.2 6.91,12.26 7.15,12.5 U$1.P20 8.4,12.45 v10.05,12.45 10.05,13.05 | C3.2 10.5,7.14 U$1.P27 | C7.2 C1.2 | v5.2,8.4 2.85,8.4 U$2.P2 C19.2 4.35,5.15 v4.35,5.5 U$7.P2 | v15.5,17.8 11.8,17.8 11.8,17.5 v9.3,17.5 U$1.P10 v6.9,17.5 | v4.6,11.55 6.7,11.55 C1.2 | U$53.P4 v5.75,15.3 | v5.75,12.25 C1.2 | U$53.P4 v6.9,15.3 | C20.1 | C16.2 11.37,4.19 C20.1 | v6,7.25 10.25,7.25 C3.2 | U$52.P2 8.35,2.25 8.35,0.9 v3.5,0.9 | C2.2 24.7,21.5 U$1.P74 v21.95,21.5 v20.55,21.5 | v23.85,25.05 U$4.P5 | v1.25,14.55 3.7,14.55 4.3,15.3 U$53.P4 | C20.1 10.35,5.46 C3.2 | C3.2 v9.4,6.75 | v15.5,22.1 v16.45,22.1 | v18.45,11.65 v12.75,11.65 12.75,13.05 10.05,13.05 | 10.05,13.05 v10.05,13.5 | v19.85,6.85 C4.2 | v19.85,5.55 C22.2 21,4.55 23,4.55 C17.1 23,5.85 C5.2 29.9,5.85 U$59.P2 | R2.1 5.5,25.8
  Bottom 0.15: v8.5,25.8 v8.5,22.5 8.5,21.65 C6.2 8.25,18.6 C8.2 | v11.55,24.7 v11.55,26.95 | C8.2 9.3,18.35 v9.3,17.5 | C18.2 v5.2,8.4 | v4.35,5.5 3.2,5.5 U$29.P$1 3.2,5.15 2.75,5.15 v3.5,3.8 v3.5,0.9 | C18.2 6,8.9 4.6,8.9 v4.6,11.55 | 15.6,17.5 U$11.P9 | v5.75,15.3 v5.75,12.25 | v6.9,15.3 v6.9,17.5 | C18.2 v6,7.25 | U$11.P7 15.6,16.3 15.6,17.5 | 15.6,17.5 v15.5,17.8 v15.5,22.1 | U$40.C U$42.C U$43.C | U$43.C U$41.C | U$43.C 21.4,25.95 21.4,24.95 21.95,24.95 21.95,23.95 | 21.95,23.95 v21.95,21.5 21.95,21.05 C10.2 | 21.95,23.95 C25.2 C26.2 23.85,23.95 v23.85,25.05 | Y1.4 9.95,12.45 v10.05,12.45 | v10.05,13.5 10.25,13.7 Y1.2 10.79,13.61 | C11.1 1.25,15.25 v1.25,14.55 | v9.4,6.75 8.9,6.25 C21.2 | v20.55,21.5 R17.1 20.35,20.65 19.8,22 18.85,22 C24.2 C23.2 17.4,22.1 v16.45,22.1 | C13.2 8.55,17.95 C8.2 | v18.45,11.65 R5.2 C9.2 v19.85,6.85 v19.85,5.55 | v12.75,11.65 C12.2
  other vias: 29.2,14.4 15.3,19.3 7.05,22.1 22.2,19.1
  pour Top (isolate 0.3): 0,0 0,32 32,32 32,0
  pour Bottom (isolate 0.3): 0,0 0,32 32,32 32,0
HSYNC  (via drill 0.2, 0.2 pad 0.81)
  Top 0.15: v15.15,16.75 v16.4,16.75 | U$1.P29 11.5,10.15 15.3,10.15 15.3,9.95 v16.4,9.95
  Bottom 0.15: v16.4,16.75 v16.4,9.95 | U$11.P8 15.15,16.9 v15.15,16.75
I2C_SCL  (via drill 0.2)
  Top 0.15: R16.1 R6.2 13.55,27.4 | U1.23 v5.95,27 8.8,27 8.8,27.4 13.55,27.4 | 13.55,27.4 v15.95,27.4 16,27.45 U$52.P14 | U$53.P2 v5.75,17.8
  Bottom 0.15: v5.75,17.8 5.95,17.8 v5.95,27 | U$11.P6 15.95,15.7 v15.95,27.4
I2C_SDA  (via drill 0.2)
  Top 0.15: v10,26.95 R18.1 R7.2 v10.9,26.95 | U$52.P15 13.46,27.85 v10,27.85 8.4,27.85 8.4,27.45 v6.4,27.45 5.7,27.45 5.7,27.4 U1.24 | v10.9,16 v17.4,16 | U$53.P3 v5.75,16.55
  Bottom 0.15: v10,26.95 v10,27.85 | v10.9,26.95 v10.9,16 | v17.4,16 U$11.P19 | v5.75,16.55 6.4,16.55 v6.4,27.45
N$1  (via drill 0.2)
  Top 0.15: U$7.P4 v7.2,4.55
  Bottom 0.15: v7.2,4.55 C21.1
N$2  (via drill 0.2)
  Top 0.15: v5.2,9.7 U$2.P4
  Bottom 0.15: C18.1 v5.2,9.7
N$3
  Bottom 0.15: R17.2 18.59,20.65 U$11.P13
N$4
  Top 0.15: R11.2 20.75,25.4 20.75,24.65 19.5,24.65 U$1.P81
N$5
  Top 0.15: U$1.P82 19,24.95 20.45,24.95 20.45,27.1 R10.2
N$6
  Top 0.15: R9.2 18.5,25.4 U$1.P83
N$7
  Top 0.15: R8.2 18,27.1 U$1.P84
N$8  (via drill 0.2)
  Top 0.15: v9.35,16.5 U$1.P12
  Bottom 0.15: Y1.3 10.8,13.05 8.35,13.05 C13.1 9.35,16.95 v9.35,16.5
N$9  (via drill 0.2)
  Top 0.15: v18.8,27.6 19.8,27.6 R8.1
  Bottom 0.15: U$40.A v18.8,27.6
N$10  (via drill 0.2)
  Top 0.15: v11.15,14.6 v12.75,14.6
  Bottom 0.15: Y1.1 9.62,13.7 R3.2 v11.15,14.6 | v12.75,14.6 C12.1
N$11  (via drill 0.2)
  Top 0.15: v18.8,25.95 19.8,25.95 R9.1
  Bottom 0.15: U$41.A v18.8,25.95
N$12  (via drill 0.2)
  Top 0.15: v22.8,28.5 21.9,28.5 R10.1
  Bottom 0.15: U$42.A 23.55,27.75 v22.8,28.5
N$13  (via drill 0.2)
  Top 0.15: v9.5,15.9 9.4,16 U$1.P13
  Bottom 0.15: R3.1 9.5,14.59 v9.5,15.9
N$14
  Top 0.15: U$1.P96 12,25.35 C15.1 R7.1
N$15  (via drill 0.2)
  Top 0.15: v21.5,9.7 U$1.P49
  Bottom 0.15: C9.1 v21.5,9.7
N$16  (via drill 0.2)
  Top 0.15: U$1.P73 v21.45,21.05
  Bottom 0.15: v21.45,21.05 21.45,20.55 C10.1
N$17
  Top 0.15: U$1.P95 12.5,25.35 C14.1 R6.1
N$18
  Top 0.15: U$1.P68 25.5,18.5 25.5,16.95 R4.1
N$19  (via drill 0.2)
  Top 0.15: v4.35,14.4 7.35,14.4 7.35,15.5 U$1.P14
  Bottom 0.15: v4.35,14.4 4.35,13.6 U$29.P$2 3.2,15.28 C11.2
N$20  (via drill 0.2)
  Top 0.15: R1.1 v3.4,24.15
  Bottom 0.15: v3.4,24.15 3.4,26.9 3.8,26.9 U$31.P$2
N$21  (via drill 0.2)
  Top 0.15: R1.2 R2.2 7,23.15 7,22.95 v9.5,22.95 | U$1.P94 13,22 v9.7,22
  Bottom 0.15: v9.7,22 9.5,22 v9.5,22.95
N$22  (via drill 0.2)
  Top 0.15: v15.5,9.3 U$1.P37
  Bottom 0.15: v15.5,9.3 17.1,9.3 R5.1
N$23  (via drill 0.2)
  Top 0.15: v22.45,25.95 21.5,25.95 R11.1
  Bottom 0.15: U$43.A v22.45,25.95
N$24
  Bottom 0.15: R13.1 U$61.P2
N$25  (via drill 0.2)
  Top 0.15: v30.55,10.1 30.55,11.3 U$54.P2
  Bottom 0.15: R15.1 v30.55,10.1
N$27
  Bottom 0.15: R12.1 2.1,20 U$55.P2
N$29
  Top 0.15: R14.1 U$57.P2
PCLK  (via drill 0.2, 0.2 pad 0.81)
  Top 0.15: v17.4,17.2 v12.15,17.2 | v12.15,9.5 12.5,9.5 U$1.P31
  Bottom 0.15: U$11.P17 v17.4,17.2 | v12.15,17.2 v12.15,9.5
SWCLK
  Top 0.15: U$1.P76 25.55,23.65 25.55,20.8 27.2,20.8 28.65,19.35 28.65,16.75 28.7,16.7 U$63.P$1
SWDIO
  Top 0.15: U$1.P72 27.1,20.5 28.35,19.25 28.35,15.5 U$64.P$1
UART4_RX  (via drill 0.2)
  Top 0.15: v27.9,9 22.35,9 22.35,10.65 9.8,10.65 9.65,10.5 U$1.P24 | v28.8,28.35 24.2,28.35 U$52.P11
  Bottom 0.15: v27.9,9 27.9,17.6 28.75,17.6 28.75,28.5 v28.8,28.35
UART4_TX  (via drill 0.2)
  Top 0.15: U$1.P23 22.7,11 22.7,9.45 v27.35,9.45
  Bottom 0.15: v27.35,9.45 27.35,17.9 28.2,17.9 28.2,29.75 U$52.P10
USB_D+  (via drill 0.2)
  Top 0.15: U$1.P71 v26.25,20 | v26.25,23.75 U$4.P3
  Bottom 0.15: v26.25,20 v26.25,23.75
USB_D-  (via drill 0.2)
  Top 0.15: U$1.P70 v26.7,19.5 | v26.7,23.1 U$4.P2
  Bottom 0.15: v26.7,19.5 v26.7,23.1
USB_ID  (via drill 0.2)
  Top 0.15: U$1.P69 25.7,19 v25.8,18.95 | v25.8,24.4 U$4.P4
  Bottom 0.15: v25.8,18.95 v25.8,24.4
USB_VBUS  (via drill 0.2)
  Top 0.15: v27.15,21.85 27.15,22.45 U$4.P1 | U$57.P1 16.3,5.5 16.3,4.25 v26.75,4.25 | v26.75,17.7 27.45,17.7 | R4.2 27.85,17.7 27.45,17.7 | 27.45,17.7 v27.45,19.5
  Bottom 0.15: v27.15,21.85 27.15,19.5 v27.45,19.5 | v26.75,4.25 v26.75,17.7
VBAT  (via drill 0.2)
  Top 0.15: U$7.P3 1.9,4.54 1.85,4.54 C19.1 1.85,7 U$2.P1 | U$7.P3 6.4,4.55 6.4,6.44 U$7.P1 5.5,6.44 5.5,6.95 3.81,6.95 U$2.P3 v3.8,7.95 | v1.8,16.15 v3.7,16.15 | U$7.P3 5.6,3.95 9.45,3.95 9.45,4.19 C16.1 9.94,3.55 12.05,3.55 | v28.9,3.55 12.05,3.55 | 12.05,3.55 R14.2 | U$5.P$1 v28.9,12.8
  Bottom 0.15: v3.8,7.95 3.8,11.9 1.8,11.9 v1.8,16.15 1.8,18.5 R12.2 | v28.9,3.55 R15.2 v28.9,12.8 | v3.7,16.15 4.2,16.15 R13.2
VBAT_C  (via drill 0.2)
  Top 0.15: U$53.P1 5.35,19.65 v5.35,19.85
  Bottom 0.15: U$55.P1 4.3,19.75 5.35,19.75 v5.35,19.85
VBAT_P
  Top 0.15: U$59.P1 U$54.P1
VBAT_S  (via drill 0.2)
  Top 0.15: v0.8,3.3 4.79,3.3 U$52.P1
  Bottom 0.15: v0.8,3.3 0.7,16.85 1.4,16.85 U$61.P1
VCC  (via drill 0.2)
  Top 0.15: R18.2 U$1.P100 10,23.6 | U1.10 1,26.2 1,27 | U1.8 1,27 | 1,27 1,28.4 4,28.4 U1.1 v5.3,27.9 | U1.22 4.9,26.6 4.9,26.55 v5.3,26.55 9.4,26.55 9.4,25.35 R18.2 | R18.2 10,25.85 14.4,25.85 R16.2 v15.05,25.35 | 10,23.27 10,23.6 | v9,23.6 10,23.6 | C1.1 6.89,13.26 7.15,13 v7.4,13 U$1.P19 | U$1.P11 v7.35,17 7.35,16.1 v6.35,16.1 | C4.1 U$1.P50 | v6.35,13.9 C1.1 | U$2.P5 2.85,9.4 2.85,10.35 4.1,10.35 4.1,13.25 C1.1 | v13.05,18.25 9.3,18.25 v9.3,19.5 U$1.P6 v7.35,19.5 7.35,21.15 v5,21.15 | v7.4,9.45 11,9.45 U$1.P28 11,7.13 C3.1 11.8,6.2 22,6.2 | C2.1 24.7,22 U$1.P75 23.65,22.3 v22.6,22.3 22.6,22.65 v20.95,22.65 | v15.05,22.65 v20.05,22.65 | C22.1 22,6.2 | 22,6.2 C4.1 | C4.1 C17.2 C5.1
  Bottom 0.15: v5.3,27.9 v5.3,26.55 | v9,23.6 C6.1 9.3,21.65 v9.3,19.5 | v7.35,19.5 7.35,18.75 C8.1 7.35,18.3 v7.35,17 | v6.35,16.1 v6.35,13.9 | U$11.P10 13.05,18.1 v13.05,18.25 | v7.4,13 v7.4,9.45 | C26.1 23.8,22.3 v22.6,22.3 22.85,22.3 C25.1 | v15.05,25.35 v15.05,22.65 | v20.05,22.65 v20.95,22.65 | U$31.P$1 4.65,21.16 v5,21.15
VCC_ANA  (via drill 0.2)
  Top 0.15: C7.1 6.85,10.5 | U$1.P22 7.3,11.5 7.3,10.5 6.85,10.5 | C20.2 8.3,5.46 U$7.P5 v6.85,6.45 | 6.85,10.5 v6.85,9.85 | v17.4,17.8 v16.4,17.8 | v11.7,20.3 v16.4,20.3 v17.85,20.3 | v11.7,11.5 U$1.P22 | U$1.P22 U$1.P21 | v12.25,28.35 4.6,28.35 4.6,28.85 0.55,28.85 0.55,24.9 U1.13
  Bottom 0.15: v6.85,9.85 v6.85,6.45 | U$11.P16 v17.4,17.8 | v16.4,17.8 v16.4,20.3 | v11.7,11.5 v11.7,20.3 11.7,22.7 12.25,22.7 v12.25,28.35 | C24.1 C23.1 v17.85,20.3
VSYNC  (via drill 0.2, 0.2 pad 0.81)
  Top 0.15: v17.4,18.4 13.5,18.4 v13.5,19.85 | U$1.P93 13.5,21.6 v13.2,21.3
  Bottom 0.15: U$11.P15 v17.4,18.4 | v13.5,19.85 13.2,20.15 v13.2,21.3
XCLK  (via drill 0.2 pad 0.81)
  Top 0.15: v19.9,18.25 19.9,18 U$1.P67
  Bottom 0.15: U$11.P18 19.9,16.6 v19.9,18.25

### Text on the board
tNames: USB | SWCLK | SWDIO | MOLEX / CONNECTOR | 3V | VBAT
bNames: BOOT1 | NRST | SMARTVISION V1 / EPFL LIS / WILLIAM PONSOT